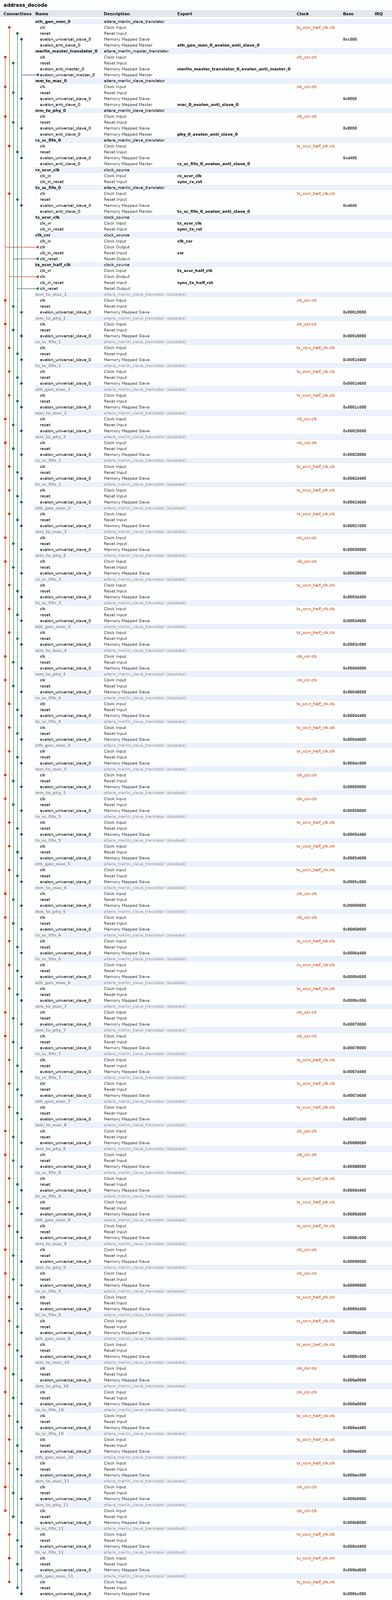
[diagram p0: system contents, whole]
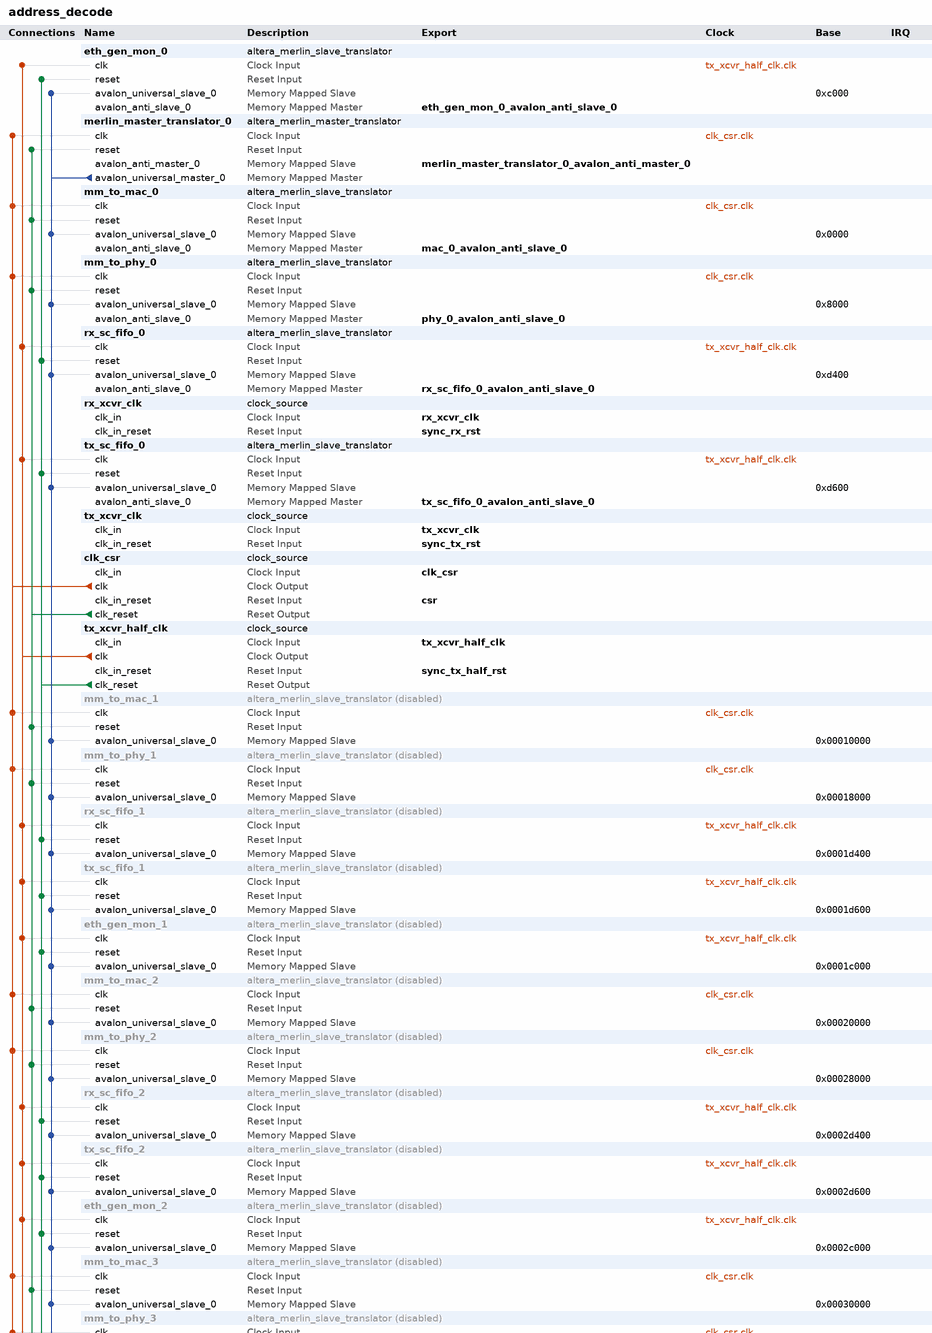
[diagram p1: system contents, upper part]
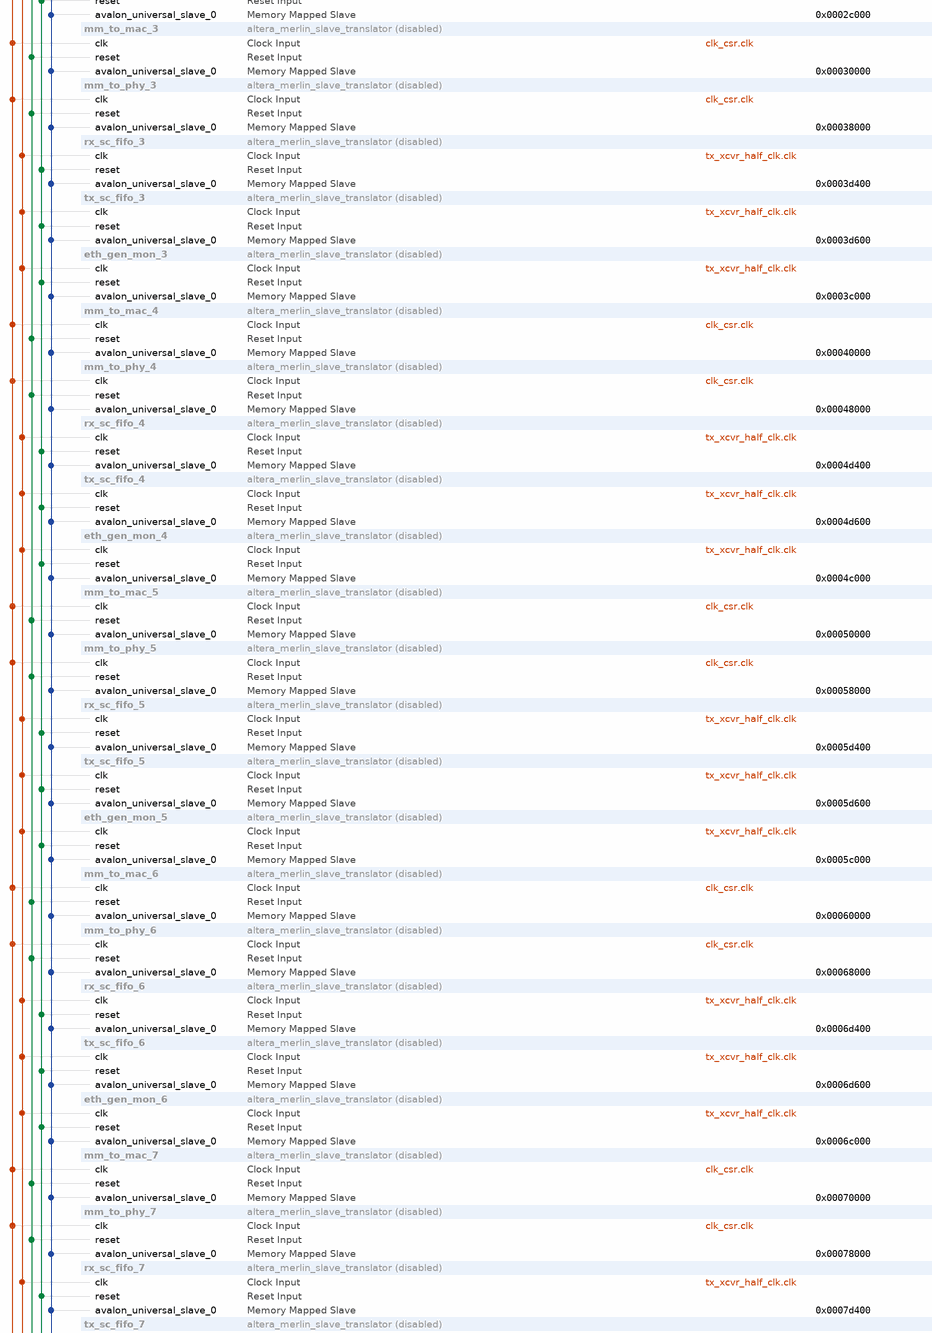
[diagram p2: system contents, middle part]
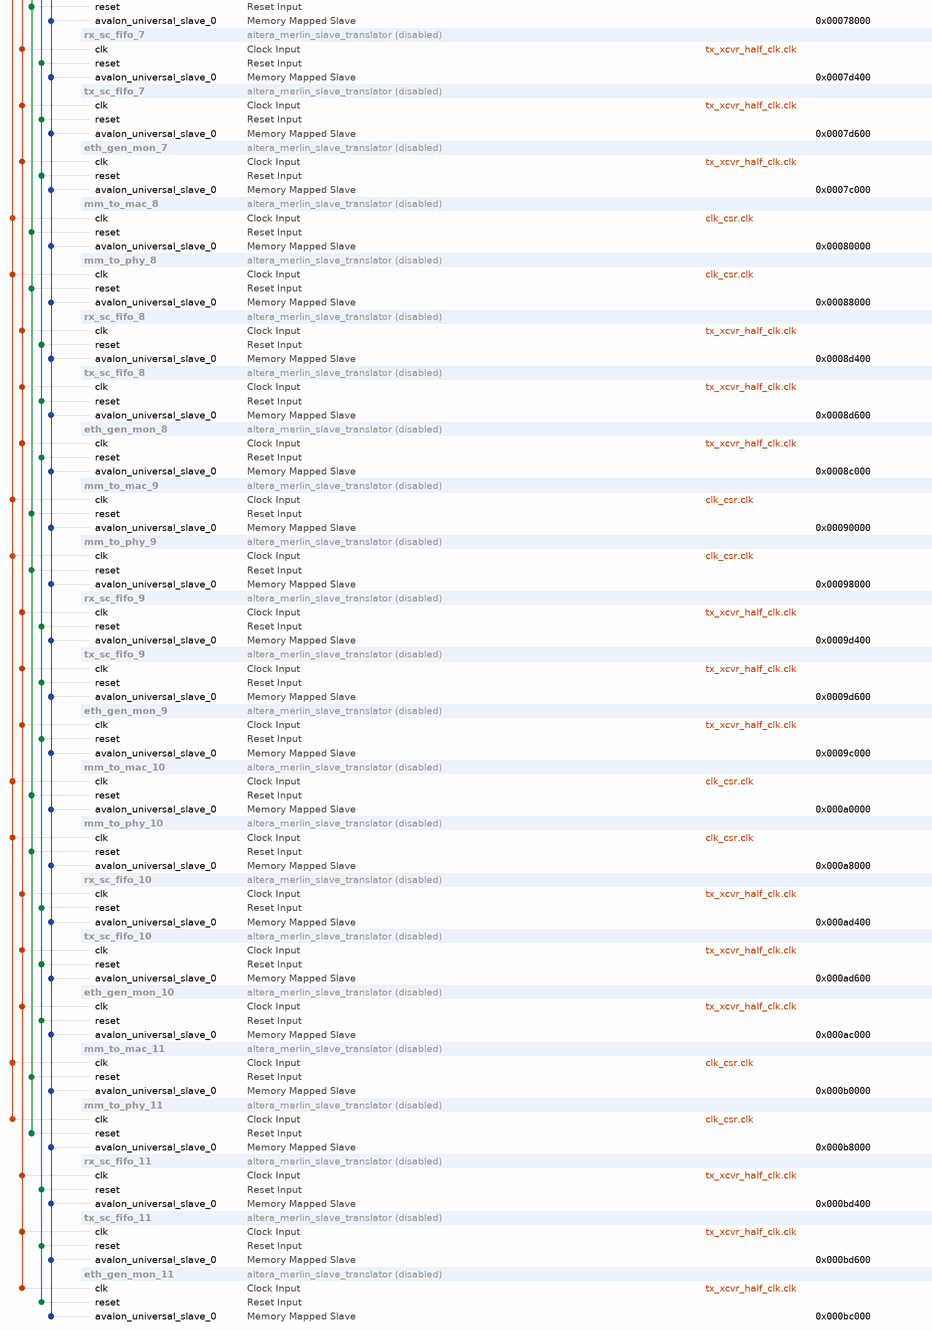
[diagram p3: system contents, lower part]
# Platform Designer (Qsys) system address_decode, Stratix 10 1SG280HU2F50E2VG
# Parameters at their usual value, and those the tool derives, are not listed.
package require -exact qsys 1.0
create_system address_decode
set_project_property DEVICE_FAMILY {Stratix 10}
set_project_property DEVICE 1SG280HU2F50E2VG

add_component eth_gen_mon_0 ip/address_decode/address_decode_eth_gen_mon.ip altera_merlin_slave_translator eth_gen_mon_0 16.925
load_component eth_gen_mon_0
set_component_parameter_value AV_ADDRESS_W 12
set_component_parameter_value AV_DATA_W 32
set_component_parameter_value UAV_DATA_W 32
set_component_parameter_value AV_BURSTCOUNT_W 4
set_component_parameter_value AV_BYTEENABLE_W 4
set_component_parameter_value UAV_BYTEENABLE_W 4
set_component_parameter_value UAV_ADDRESS_W 14
set_component_parameter_value UAV_BURSTCOUNT_W 4
set_component_parameter_value AV_READLATENCY 0
set_component_parameter_value AV_SETUP_WAIT 0
set_component_parameter_value AV_WRITE_WAIT 0
set_component_parameter_value AV_READ_WAIT 1
set_component_parameter_value AV_DATA_HOLD 0
set_component_parameter_value AV_TIMING_UNITS 1
set_component_parameter_value USE_READDATA 1
set_component_parameter_value USE_WRITEDATA 1
set_component_parameter_value USE_READ 1
set_component_parameter_value USE_WRITE 1
set_component_parameter_value USE_BEGINBURSTTRANSFER 0
set_component_parameter_value USE_BEGINTRANSFER 0
set_component_parameter_value USE_BYTEENABLE 0
set_component_parameter_value USE_CHIPSELECT 0
set_component_parameter_value USE_ADDRESS 1
set_component_parameter_value USE_BURSTCOUNT 0
set_component_parameter_value USE_READDATAVALID 0
set_component_parameter_value USE_WAITREQUEST 1
set_component_parameter_value USE_WRITEBYTEENABLE 0
set_component_parameter_value USE_LOCK 0
set_component_parameter_value USE_AV_CLKEN 0
set_component_parameter_value USE_UAV_CLKEN 0
set_component_parameter_value USE_OUTPUTENABLE 0
set_component_parameter_value USE_DEBUGACCESS 0
set_component_parameter_value USE_READRESPONSE 0
set_component_parameter_value USE_WRITERESPONSE 0
set_component_parameter_value AV_SYMBOLS_PER_WORD 4
set_component_parameter_value AV_ADDRESS_SYMBOLS 1
set_component_parameter_value AV_BURSTCOUNT_SYMBOLS 1
set_component_parameter_value AV_CONSTANT_BURST_BEHAVIOR 0
set_component_parameter_value UAV_CONSTANT_BURST_BEHAVIOR 0
set_component_parameter_value AV_REQUIRE_UNALIGNED_ADDRESSES 0
set_component_parameter_value AV_LINEWRAPBURSTS 0
set_component_parameter_value AV_MAX_PENDING_READ_TRANSACTIONS 64
set_component_parameter_value AV_MAX_PENDING_WRITE_TRANSACTIONS 0
set_component_parameter_value AV_BURSTBOUNDARIES 0
set_component_parameter_value AV_INTERLEAVEBURSTS 0
set_component_parameter_value AV_BITS_PER_SYMBOL 8
set_component_parameter_value AV_ISBIGENDIAN 0
set_component_parameter_value AV_ADDRESSGROUP 0
set_component_parameter_value UAV_ADDRESSGROUP 0
set_component_parameter_value AV_REGISTEROUTGOINGSIGNALS 0
set_component_parameter_value AV_REGISTERINCOMINGSIGNALS 0
set_component_parameter_value AV_ALWAYSBURSTMAXBURST 0
set_component_parameter_value CHIPSELECT_THROUGH_READLATENCY 0
set_component_parameter_value CLOCK_RATE 156250000
set_component_parameter_value AV_READ_WAIT_CYCLES 1
set_component_parameter_value AV_WRITE_WAIT_CYCLES 0
set_component_parameter_value AV_SETUP_WAIT_CYCLES 0
set_component_parameter_value AV_DATA_HOLD_CYCLES 0
save_component

add_component merlin_master_translator_0 ip/address_decode/address_decode_merlin_master_translator_0.ip altera_merlin_master_translator merlin_master_translator_0 16.925
load_component merlin_master_translator_0
set_component_parameter_value AV_ADDRESS_W 16
set_component_parameter_value AV_DATA_W 32
set_component_parameter_value AV_BURSTCOUNT_W 1
set_component_parameter_value AV_BYTEENABLE_W 4
set_component_parameter_value UAV_ADDRESS_W 32
set_component_parameter_value UAV_BURSTCOUNT_W 10
set_component_parameter_value AV_READLATENCY 0
set_component_parameter_value AV_WRITE_WAIT 0
set_component_parameter_value AV_READ_WAIT 0
set_component_parameter_value AV_DATA_HOLD 0
set_component_parameter_value AV_SETUP_WAIT 0
set_component_parameter_value USE_READDATA 1
set_component_parameter_value USE_WRITEDATA 1
set_component_parameter_value USE_READ 1
set_component_parameter_value USE_WRITE 1
set_component_parameter_value USE_BEGINBURSTTRANSFER 0
set_component_parameter_value USE_BEGINTRANSFER 0
set_component_parameter_value USE_BYTEENABLE 0
set_component_parameter_value USE_CHIPSELECT 0
set_component_parameter_value USE_ADDRESS 1
set_component_parameter_value USE_BURSTCOUNT 0
set_component_parameter_value USE_DEBUGACCESS 0
set_component_parameter_value USE_CLKEN 0
set_component_parameter_value USE_READDATAVALID 0
set_component_parameter_value USE_WAITREQUEST 1
set_component_parameter_value USE_LOCK 0
set_component_parameter_value USE_READRESPONSE 0
set_component_parameter_value USE_WRITERESPONSE 0
set_component_parameter_value AV_SYMBOLS_PER_WORD 4
set_component_parameter_value AV_ADDRESS_SYMBOLS 0
set_component_parameter_value AV_BURSTCOUNT_SYMBOLS 0
set_component_parameter_value AV_CONSTANT_BURST_BEHAVIOR 0
set_component_parameter_value UAV_CONSTANT_BURST_BEHAVIOR 0
set_component_parameter_value AV_LINEWRAPBURSTS 0
set_component_parameter_value AV_MAX_PENDING_READ_TRANSACTIONS 0
set_component_parameter_value AV_BURSTBOUNDARIES 0
set_component_parameter_value AV_INTERLEAVEBURSTS 0
set_component_parameter_value AV_BITS_PER_SYMBOL 8
set_component_parameter_value AV_ISBIGENDIAN 0
set_component_parameter_value AV_ADDRESSGROUP 0
set_component_parameter_value UAV_ADDRESSGROUP 0
set_component_parameter_value AV_REGISTEROUTGOINGSIGNALS 0
set_component_parameter_value AV_REGISTERINCOMINGSIGNALS 0
set_component_parameter_value AV_ALWAYSBURSTMAXBURST 0
set_component_parameter_value SYNC_RESET 0
save_component

add_component mm_to_mac_0 ip/address_decode/address_decode_mm_to_mac.ip altera_merlin_slave_translator mm_to_mac_0 16.925

add_component mm_to_phy_0 ip/address_decode/address_decode_mm_to_phy.ip altera_merlin_slave_translator mm_to_phy_0 16.925

add_component rx_sc_fifo_0 ip/address_decode/address_decode_rx_sc_fifo.ip altera_merlin_slave_translator rx_sc_fifo_0 16.925
load_component rx_sc_fifo_0
set_component_parameter_value AV_ADDRESS_W 3
set_component_parameter_value AV_DATA_W 32
set_component_parameter_value UAV_DATA_W 32
set_component_parameter_value AV_BURSTCOUNT_W 4
set_component_parameter_value AV_BYTEENABLE_W 4
set_component_parameter_value UAV_BYTEENABLE_W 4
set_component_parameter_value UAV_ADDRESS_W 5
set_component_parameter_value UAV_BURSTCOUNT_W 4
set_component_parameter_value AV_READLATENCY 0
set_component_parameter_value AV_SETUP_WAIT 0
set_component_parameter_value AV_WRITE_WAIT 0
set_component_parameter_value AV_READ_WAIT 1
set_component_parameter_value AV_DATA_HOLD 0
set_component_parameter_value AV_TIMING_UNITS 1
set_component_parameter_value USE_READDATA 1
set_component_parameter_value USE_WRITEDATA 1
set_component_parameter_value USE_READ 1
set_component_parameter_value USE_WRITE 1
set_component_parameter_value USE_BEGINBURSTTRANSFER 0
set_component_parameter_value USE_BEGINTRANSFER 0
set_component_parameter_value USE_BYTEENABLE 0
set_component_parameter_value USE_CHIPSELECT 0
set_component_parameter_value USE_ADDRESS 1
set_component_parameter_value USE_BURSTCOUNT 0
set_component_parameter_value USE_READDATAVALID 0
set_component_parameter_value USE_WAITREQUEST 0
set_component_parameter_value USE_WRITEBYTEENABLE 0
set_component_parameter_value USE_LOCK 0
set_component_parameter_value USE_AV_CLKEN 0
set_component_parameter_value USE_UAV_CLKEN 0
set_component_parameter_value USE_OUTPUTENABLE 0
set_component_parameter_value USE_DEBUGACCESS 0
set_component_parameter_value USE_READRESPONSE 0
set_component_parameter_value USE_WRITERESPONSE 0
set_component_parameter_value AV_SYMBOLS_PER_WORD 4
set_component_parameter_value AV_ADDRESS_SYMBOLS 0
set_component_parameter_value AV_BURSTCOUNT_SYMBOLS 0
set_component_parameter_value AV_CONSTANT_BURST_BEHAVIOR 0
set_component_parameter_value UAV_CONSTANT_BURST_BEHAVIOR 0
set_component_parameter_value AV_REQUIRE_UNALIGNED_ADDRESSES 0
set_component_parameter_value AV_LINEWRAPBURSTS 0
set_component_parameter_value AV_MAX_PENDING_READ_TRANSACTIONS 64
set_component_parameter_value AV_MAX_PENDING_WRITE_TRANSACTIONS 0
set_component_parameter_value AV_BURSTBOUNDARIES 0
set_component_parameter_value AV_INTERLEAVEBURSTS 0
set_component_parameter_value AV_BITS_PER_SYMBOL 8
set_component_parameter_value AV_ISBIGENDIAN 0
set_component_parameter_value AV_ADDRESSGROUP 0
set_component_parameter_value UAV_ADDRESSGROUP 0
set_component_parameter_value AV_REGISTEROUTGOINGSIGNALS 0
set_component_parameter_value AV_REGISTERINCOMINGSIGNALS 0
set_component_parameter_value AV_ALWAYSBURSTMAXBURST 0
set_component_parameter_value CHIPSELECT_THROUGH_READLATENCY 0
set_component_parameter_value CLOCK_RATE 156250000
set_component_parameter_value AV_READ_WAIT_CYCLES 1
set_component_parameter_value AV_WRITE_WAIT_CYCLES 0
set_component_parameter_value AV_SETUP_WAIT_CYCLES 0
set_component_parameter_value AV_DATA_HOLD_CYCLES 0
save_component

add_component rx_xcvr_clk ip/address_decode/address_decode_rx_xcvr_clk.ip clock_source rx_xcvr_clk 

add_component tx_sc_fifo_0 ip/address_decode/address_decode_tx_sc_fifo.ip altera_merlin_slave_translator tx_sc_fifo_0 16.925

add_component tx_xcvr_clk ip/address_decode/address_decode_tx_xcvr_clk.ip clock_source tx_xcvr_clk 
load_component tx_xcvr_clk
set_component_parameter_value clockFrequency 312500000
save_component

add_component clk_csr ip/address_decode/address_decode_clk_csr.ip clock_source clk_csr 

add_component tx_xcvr_half_clk ip/address_decode/address_decode_tx_xcvr_half_clk.ip clock_source tx_xcvr_half_clk 
load_component tx_xcvr_half_clk
set_component_parameter_value clockFrequency 156250000
save_component

add_component mm_to_mac_1 ip/address_decode/address_decode_mm_to_mac.ip altera_merlin_slave_translator mm_to_mac_1 16.925
set_instance_property mm_to_mac_1 ENABLED false

add_component mm_to_phy_1 ip/address_decode/address_decode_mm_to_phy.ip altera_merlin_slave_translator mm_to_phy_1 16.925
set_instance_property mm_to_phy_1 ENABLED false

add_component rx_sc_fifo_1 ip/address_decode/address_decode_rx_sc_fifo.ip altera_merlin_slave_translator rx_sc_fifo_1 16.925
load_component rx_sc_fifo_1
set_instance_property rx_sc_fifo_1 ENABLED false
set_component_parameter_value AV_ADDRESS_W 3
set_component_parameter_value AV_DATA_W 32
set_component_parameter_value UAV_DATA_W 32
set_component_parameter_value AV_BURSTCOUNT_W 4
set_component_parameter_value AV_BYTEENABLE_W 4
set_component_parameter_value UAV_BYTEENABLE_W 4
set_component_parameter_value UAV_ADDRESS_W 5
set_component_parameter_value UAV_BURSTCOUNT_W 4
set_component_parameter_value AV_READLATENCY 0
set_component_parameter_value AV_SETUP_WAIT 0
set_component_parameter_value AV_WRITE_WAIT 0
set_component_parameter_value AV_READ_WAIT 1
set_component_parameter_value AV_DATA_HOLD 0
set_component_parameter_value AV_TIMING_UNITS 1
set_component_parameter_value USE_READDATA 1
set_component_parameter_value USE_WRITEDATA 1
set_component_parameter_value USE_READ 1
set_component_parameter_value USE_WRITE 1
set_component_parameter_value USE_BEGINBURSTTRANSFER 0
set_component_parameter_value USE_BEGINTRANSFER 0
set_component_parameter_value USE_BYTEENABLE 0
set_component_parameter_value USE_CHIPSELECT 0
set_component_parameter_value USE_ADDRESS 1
set_component_parameter_value USE_BURSTCOUNT 0
set_component_parameter_value USE_READDATAVALID 0
set_component_parameter_value USE_WAITREQUEST 0
set_component_parameter_value USE_WRITEBYTEENABLE 0
set_component_parameter_value USE_LOCK 0
set_component_parameter_value USE_AV_CLKEN 0
set_component_parameter_value USE_UAV_CLKEN 0
set_component_parameter_value USE_OUTPUTENABLE 0
set_component_parameter_value USE_DEBUGACCESS 0
set_component_parameter_value USE_READRESPONSE 0
set_component_parameter_value USE_WRITERESPONSE 0
set_component_parameter_value AV_SYMBOLS_PER_WORD 4
set_component_parameter_value AV_ADDRESS_SYMBOLS 0
set_component_parameter_value AV_BURSTCOUNT_SYMBOLS 0
set_component_parameter_value AV_CONSTANT_BURST_BEHAVIOR 0
set_component_parameter_value UAV_CONSTANT_BURST_BEHAVIOR 0
set_component_parameter_value AV_REQUIRE_UNALIGNED_ADDRESSES 0
set_component_parameter_value AV_LINEWRAPBURSTS 0
set_component_parameter_value AV_MAX_PENDING_READ_TRANSACTIONS 64
set_component_parameter_value AV_MAX_PENDING_WRITE_TRANSACTIONS 0
set_component_parameter_value AV_BURSTBOUNDARIES 0
set_component_parameter_value AV_INTERLEAVEBURSTS 0
set_component_parameter_value AV_BITS_PER_SYMBOL 8
set_component_parameter_value AV_ISBIGENDIAN 0
set_component_parameter_value AV_ADDRESSGROUP 0
set_component_parameter_value UAV_ADDRESSGROUP 0
set_component_parameter_value AV_REGISTEROUTGOINGSIGNALS 0
set_component_parameter_value AV_REGISTERINCOMINGSIGNALS 0
set_component_parameter_value AV_ALWAYSBURSTMAXBURST 0
set_component_parameter_value CHIPSELECT_THROUGH_READLATENCY 0
set_component_parameter_value CLOCK_RATE 156250000
set_component_parameter_value AV_READ_WAIT_CYCLES 1
set_component_parameter_value AV_WRITE_WAIT_CYCLES 0
set_component_parameter_value AV_SETUP_WAIT_CYCLES 0
set_component_parameter_value AV_DATA_HOLD_CYCLES 0
save_component

add_component tx_sc_fifo_1 ip/address_decode/address_decode_tx_sc_fifo.ip altera_merlin_slave_translator tx_sc_fifo_1 18.1
set_instance_property tx_sc_fifo_1 ENABLED false

add_component eth_gen_mon_1 ip/address_decode/address_decode_eth_gen_mon.ip altera_merlin_slave_translator eth_gen_mon_1 16.925
load_component eth_gen_mon_1
set_instance_property eth_gen_mon_1 ENABLED false
set_component_parameter_value AV_ADDRESS_W 12
set_component_parameter_value AV_DATA_W 32
set_component_parameter_value UAV_DATA_W 32
set_component_parameter_value AV_BURSTCOUNT_W 4
set_component_parameter_value AV_BYTEENABLE_W 4
set_component_parameter_value UAV_BYTEENABLE_W 4
set_component_parameter_value UAV_ADDRESS_W 14
set_component_parameter_value UAV_BURSTCOUNT_W 4
set_component_parameter_value AV_READLATENCY 0
set_component_parameter_value AV_SETUP_WAIT 0
set_component_parameter_value AV_WRITE_WAIT 0
set_component_parameter_value AV_READ_WAIT 1
set_component_parameter_value AV_DATA_HOLD 0
set_component_parameter_value AV_TIMING_UNITS 1
set_component_parameter_value USE_READDATA 1
set_component_parameter_value USE_WRITEDATA 1
set_component_parameter_value USE_READ 1
set_component_parameter_value USE_WRITE 1
set_component_parameter_value USE_BEGINBURSTTRANSFER 0
set_component_parameter_value USE_BEGINTRANSFER 0
set_component_parameter_value USE_BYTEENABLE 0
set_component_parameter_value USE_CHIPSELECT 0
set_component_parameter_value USE_ADDRESS 1
set_component_parameter_value USE_BURSTCOUNT 0
set_component_parameter_value USE_READDATAVALID 0
set_component_parameter_value USE_WAITREQUEST 1
set_component_parameter_value USE_WRITEBYTEENABLE 0
set_component_parameter_value USE_LOCK 0
set_component_parameter_value USE_AV_CLKEN 0
set_component_parameter_value USE_UAV_CLKEN 0
set_component_parameter_value USE_OUTPUTENABLE 0
set_component_parameter_value USE_DEBUGACCESS 0
set_component_parameter_value USE_READRESPONSE 0
set_component_parameter_value USE_WRITERESPONSE 0
set_component_parameter_value AV_SYMBOLS_PER_WORD 4
set_component_parameter_value AV_ADDRESS_SYMBOLS 1
set_component_parameter_value AV_BURSTCOUNT_SYMBOLS 1
set_component_parameter_value AV_CONSTANT_BURST_BEHAVIOR 0
set_component_parameter_value UAV_CONSTANT_BURST_BEHAVIOR 0
set_component_parameter_value AV_REQUIRE_UNALIGNED_ADDRESSES 0
set_component_parameter_value AV_LINEWRAPBURSTS 0
set_component_parameter_value AV_MAX_PENDING_READ_TRANSACTIONS 64
set_component_parameter_value AV_MAX_PENDING_WRITE_TRANSACTIONS 0
set_component_parameter_value AV_BURSTBOUNDARIES 0
set_component_parameter_value AV_INTERLEAVEBURSTS 0
set_component_parameter_value AV_BITS_PER_SYMBOL 8
set_component_parameter_value AV_ISBIGENDIAN 0
set_component_parameter_value AV_ADDRESSGROUP 0
set_component_parameter_value UAV_ADDRESSGROUP 0
set_component_parameter_value AV_REGISTEROUTGOINGSIGNALS 0
set_component_parameter_value AV_REGISTERINCOMINGSIGNALS 0
set_component_parameter_value AV_ALWAYSBURSTMAXBURST 0
set_component_parameter_value CHIPSELECT_THROUGH_READLATENCY 0
set_component_parameter_value CLOCK_RATE 156250000
set_component_parameter_value AV_READ_WAIT_CYCLES 1
set_component_parameter_value AV_WRITE_WAIT_CYCLES 0
set_component_parameter_value AV_SETUP_WAIT_CYCLES 0
set_component_parameter_value AV_DATA_HOLD_CYCLES 0
save_component

add_component mm_to_mac_2 ip/address_decode/address_decode_mm_to_mac.ip altera_merlin_slave_translator mm_to_mac_2 16.925
set_instance_property mm_to_mac_2 ENABLED false

add_component mm_to_phy_2 ip/address_decode/address_decode_mm_to_phy.ip altera_merlin_slave_translator mm_to_phy_2 16.925
set_instance_property mm_to_phy_2 ENABLED false

add_component rx_sc_fifo_2 ip/address_decode/address_decode_rx_sc_fifo.ip altera_merlin_slave_translator rx_sc_fifo_2 16.925
load_component rx_sc_fifo_2
set_instance_property rx_sc_fifo_2 ENABLED false
set_component_parameter_value AV_ADDRESS_W 3
set_component_parameter_value AV_DATA_W 32
set_component_parameter_value UAV_DATA_W 32
set_component_parameter_value AV_BURSTCOUNT_W 4
set_component_parameter_value AV_BYTEENABLE_W 4
set_component_parameter_value UAV_BYTEENABLE_W 4
set_component_parameter_value UAV_ADDRESS_W 5
set_component_parameter_value UAV_BURSTCOUNT_W 4
set_component_parameter_value AV_READLATENCY 0
set_component_parameter_value AV_SETUP_WAIT 0
set_component_parameter_value AV_WRITE_WAIT 0
set_component_parameter_value AV_READ_WAIT 1
set_component_parameter_value AV_DATA_HOLD 0
set_component_parameter_value AV_TIMING_UNITS 1
set_component_parameter_value USE_READDATA 1
set_component_parameter_value USE_WRITEDATA 1
set_component_parameter_value USE_READ 1
set_component_parameter_value USE_WRITE 1
set_component_parameter_value USE_BEGINBURSTTRANSFER 0
set_component_parameter_value USE_BEGINTRANSFER 0
set_component_parameter_value USE_BYTEENABLE 0
set_component_parameter_value USE_CHIPSELECT 0
set_component_parameter_value USE_ADDRESS 1
set_component_parameter_value USE_BURSTCOUNT 0
set_component_parameter_value USE_READDATAVALID 0
set_component_parameter_value USE_WAITREQUEST 0
set_component_parameter_value USE_WRITEBYTEENABLE 0
set_component_parameter_value USE_LOCK 0
set_component_parameter_value USE_AV_CLKEN 0
set_component_parameter_value USE_UAV_CLKEN 0
set_component_parameter_value USE_OUTPUTENABLE 0
set_component_parameter_value USE_DEBUGACCESS 0
set_component_parameter_value USE_READRESPONSE 0
set_component_parameter_value USE_WRITERESPONSE 0
set_component_parameter_value AV_SYMBOLS_PER_WORD 4
set_component_parameter_value AV_ADDRESS_SYMBOLS 0
set_component_parameter_value AV_BURSTCOUNT_SYMBOLS 0
set_component_parameter_value AV_CONSTANT_BURST_BEHAVIOR 0
set_component_parameter_value UAV_CONSTANT_BURST_BEHAVIOR 0
set_component_parameter_value AV_REQUIRE_UNALIGNED_ADDRESSES 0
set_component_parameter_value AV_LINEWRAPBURSTS 0
set_component_parameter_value AV_MAX_PENDING_READ_TRANSACTIONS 64
set_component_parameter_value AV_MAX_PENDING_WRITE_TRANSACTIONS 0
set_component_parameter_value AV_BURSTBOUNDARIES 0
set_component_parameter_value AV_INTERLEAVEBURSTS 0
set_component_parameter_value AV_BITS_PER_SYMBOL 8
set_component_parameter_value AV_ISBIGENDIAN 0
set_component_parameter_value AV_ADDRESSGROUP 0
set_component_parameter_value UAV_ADDRESSGROUP 0
set_component_parameter_value AV_REGISTEROUTGOINGSIGNALS 0
set_component_parameter_value AV_REGISTERINCOMINGSIGNALS 0
set_component_parameter_value AV_ALWAYSBURSTMAXBURST 0
set_component_parameter_value CHIPSELECT_THROUGH_READLATENCY 0
set_component_parameter_value CLOCK_RATE 156250000
set_component_parameter_value AV_READ_WAIT_CYCLES 1
set_component_parameter_value AV_WRITE_WAIT_CYCLES 0
set_component_parameter_value AV_SETUP_WAIT_CYCLES 0
set_component_parameter_value AV_DATA_HOLD_CYCLES 0
save_component

add_component tx_sc_fifo_2 ip/address_decode/address_decode_tx_sc_fifo.ip altera_merlin_slave_translator tx_sc_fifo_2 16.925
set_instance_property tx_sc_fifo_2 ENABLED false

add_component eth_gen_mon_2 ip/address_decode/address_decode_eth_gen_mon.ip altera_merlin_slave_translator eth_gen_mon_2 16.925
load_component eth_gen_mon_2
set_instance_property eth_gen_mon_2 ENABLED false
set_component_parameter_value AV_ADDRESS_W 12
set_component_parameter_value AV_DATA_W 32
set_component_parameter_value UAV_DATA_W 32
set_component_parameter_value AV_BURSTCOUNT_W 4
set_component_parameter_value AV_BYTEENABLE_W 4
set_component_parameter_value UAV_BYTEENABLE_W 4
set_component_parameter_value UAV_ADDRESS_W 14
set_component_parameter_value UAV_BURSTCOUNT_W 4
set_component_parameter_value AV_READLATENCY 0
set_component_parameter_value AV_SETUP_WAIT 0
set_component_parameter_value AV_WRITE_WAIT 0
set_component_parameter_value AV_READ_WAIT 1
set_component_parameter_value AV_DATA_HOLD 0
set_component_parameter_value AV_TIMING_UNITS 1
set_component_parameter_value USE_READDATA 1
set_component_parameter_value USE_WRITEDATA 1
set_component_parameter_value USE_READ 1
set_component_parameter_value USE_WRITE 1
set_component_parameter_value USE_BEGINBURSTTRANSFER 0
set_component_parameter_value USE_BEGINTRANSFER 0
set_component_parameter_value USE_BYTEENABLE 0
set_component_parameter_value USE_CHIPSELECT 0
set_component_parameter_value USE_ADDRESS 1
set_component_parameter_value USE_BURSTCOUNT 0
set_component_parameter_value USE_READDATAVALID 0
set_component_parameter_value USE_WAITREQUEST 1
set_component_parameter_value USE_WRITEBYTEENABLE 0
set_component_parameter_value USE_LOCK 0
set_component_parameter_value USE_AV_CLKEN 0
set_component_parameter_value USE_UAV_CLKEN 0
set_component_parameter_value USE_OUTPUTENABLE 0
set_component_parameter_value USE_DEBUGACCESS 0
set_component_parameter_value USE_READRESPONSE 0
set_component_parameter_value USE_WRITERESPONSE 0
set_component_parameter_value AV_SYMBOLS_PER_WORD 4
set_component_parameter_value AV_ADDRESS_SYMBOLS 1
set_component_parameter_value AV_BURSTCOUNT_SYMBOLS 1
set_component_parameter_value AV_CONSTANT_BURST_BEHAVIOR 0
set_component_parameter_value UAV_CONSTANT_BURST_BEHAVIOR 0
set_component_parameter_value AV_REQUIRE_UNALIGNED_ADDRESSES 0
set_component_parameter_value AV_LINEWRAPBURSTS 0
set_component_parameter_value AV_MAX_PENDING_READ_TRANSACTIONS 64
set_component_parameter_value AV_MAX_PENDING_WRITE_TRANSACTIONS 0
set_component_parameter_value AV_BURSTBOUNDARIES 0
set_component_parameter_value AV_INTERLEAVEBURSTS 0
set_component_parameter_value AV_BITS_PER_SYMBOL 8
set_component_parameter_value AV_ISBIGENDIAN 0
set_component_parameter_value AV_ADDRESSGROUP 0
set_component_parameter_value UAV_ADDRESSGROUP 0
set_component_parameter_value AV_REGISTEROUTGOINGSIGNALS 0
set_component_parameter_value AV_REGISTERINCOMINGSIGNALS 0
set_component_parameter_value AV_ALWAYSBURSTMAXBURST 0
set_component_parameter_value CHIPSELECT_THROUGH_READLATENCY 0
set_component_parameter_value CLOCK_RATE 156250000
set_component_parameter_value AV_READ_WAIT_CYCLES 1
set_component_parameter_value AV_WRITE_WAIT_CYCLES 0
set_component_parameter_value AV_SETUP_WAIT_CYCLES 0
set_component_parameter_value AV_DATA_HOLD_CYCLES 0
save_component

add_component mm_to_mac_3 ip/address_decode/address_decode_mm_to_mac.ip altera_merlin_slave_translator mm_to_mac_3 16.925
set_instance_property mm_to_mac_3 ENABLED false

add_component mm_to_phy_3 ip/address_decode/address_decode_mm_to_phy.ip altera_merlin_slave_translator mm_to_phy_3 16.925
set_instance_property mm_to_phy_3 ENABLED false

add_component rx_sc_fifo_3 ip/address_decode/address_decode_rx_sc_fifo.ip altera_merlin_slave_translator rx_sc_fifo_3 16.925
load_component rx_sc_fifo_3
set_instance_property rx_sc_fifo_3 ENABLED false
set_component_parameter_value AV_ADDRESS_W 3
set_component_parameter_value AV_DATA_W 32
set_component_parameter_value UAV_DATA_W 32
set_component_parameter_value AV_BURSTCOUNT_W 4
set_component_parameter_value AV_BYTEENABLE_W 4
set_component_parameter_value UAV_BYTEENABLE_W 4
set_component_parameter_value UAV_ADDRESS_W 5
set_component_parameter_value UAV_BURSTCOUNT_W 4
set_component_parameter_value AV_READLATENCY 0
set_component_parameter_value AV_SETUP_WAIT 0
set_component_parameter_value AV_WRITE_WAIT 0
set_component_parameter_value AV_READ_WAIT 1
set_component_parameter_value AV_DATA_HOLD 0
set_component_parameter_value AV_TIMING_UNITS 1
set_component_parameter_value USE_READDATA 1
set_component_parameter_value USE_WRITEDATA 1
set_component_parameter_value USE_READ 1
set_component_parameter_value USE_WRITE 1
set_component_parameter_value USE_BEGINBURSTTRANSFER 0
set_component_parameter_value USE_BEGINTRANSFER 0
set_component_parameter_value USE_BYTEENABLE 0
set_component_parameter_value USE_CHIPSELECT 0
set_component_parameter_value USE_ADDRESS 1
set_component_parameter_value USE_BURSTCOUNT 0
set_component_parameter_value USE_READDATAVALID 0
set_component_parameter_value USE_WAITREQUEST 0
set_component_parameter_value USE_WRITEBYTEENABLE 0
set_component_parameter_value USE_LOCK 0
set_component_parameter_value USE_AV_CLKEN 0
set_component_parameter_value USE_UAV_CLKEN 0
set_component_parameter_value USE_OUTPUTENABLE 0
set_component_parameter_value USE_DEBUGACCESS 0
set_component_parameter_value USE_READRESPONSE 0
set_component_parameter_value USE_WRITERESPONSE 0
set_component_parameter_value AV_SYMBOLS_PER_WORD 4
set_component_parameter_value AV_ADDRESS_SYMBOLS 0
set_component_parameter_value AV_BURSTCOUNT_SYMBOLS 0
set_component_parameter_value AV_CONSTANT_BURST_BEHAVIOR 0
set_component_parameter_value UAV_CONSTANT_BURST_BEHAVIOR 0
set_component_parameter_value AV_REQUIRE_UNALIGNED_ADDRESSES 0
set_component_parameter_value AV_LINEWRAPBURSTS 0
set_component_parameter_value AV_MAX_PENDING_READ_TRANSACTIONS 64
set_component_parameter_value AV_MAX_PENDING_WRITE_TRANSACTIONS 0
set_component_parameter_value AV_BURSTBOUNDARIES 0
set_component_parameter_value AV_INTERLEAVEBURSTS 0
set_component_parameter_value AV_BITS_PER_SYMBOL 8
set_component_parameter_value AV_ISBIGENDIAN 0
set_component_parameter_value AV_ADDRESSGROUP 0
set_component_parameter_value UAV_ADDRESSGROUP 0
set_component_parameter_value AV_REGISTEROUTGOINGSIGNALS 0
set_component_parameter_value AV_REGISTERINCOMINGSIGNALS 0
set_component_parameter_value AV_ALWAYSBURSTMAXBURST 0
set_component_parameter_value CHIPSELECT_THROUGH_READLATENCY 0
set_component_parameter_value CLOCK_RATE 156250000
set_component_parameter_value AV_READ_WAIT_CYCLES 1
set_component_parameter_value AV_WRITE_WAIT_CYCLES 0
set_component_parameter_value AV_SETUP_WAIT_CYCLES 0
set_component_parameter_value AV_DATA_HOLD_CYCLES 0
save_component

add_component tx_sc_fifo_3 ip/address_decode/address_decode_tx_sc_fifo.ip altera_merlin_slave_translator tx_sc_fifo_3 16.925
set_instance_property tx_sc_fifo_3 ENABLED false

add_component eth_gen_mon_3 ip/address_decode/address_decode_eth_gen_mon.ip altera_merlin_slave_translator eth_gen_mon_3 16.925
load_component eth_gen_mon_3
set_instance_property eth_gen_mon_3 ENABLED false
set_component_parameter_value AV_ADDRESS_W 12
set_component_parameter_value AV_DATA_W 32
set_component_parameter_value UAV_DATA_W 32
set_component_parameter_value AV_BURSTCOUNT_W 4
set_component_parameter_value AV_BYTEENABLE_W 4
set_component_parameter_value UAV_BYTEENABLE_W 4
set_component_parameter_value UAV_ADDRESS_W 14
set_component_parameter_value UAV_BURSTCOUNT_W 4
set_component_parameter_value AV_READLATENCY 0
set_component_parameter_value AV_SETUP_WAIT 0
set_component_parameter_value AV_WRITE_WAIT 0
set_component_parameter_value AV_READ_WAIT 1
set_component_parameter_value AV_DATA_HOLD 0
set_component_parameter_value AV_TIMING_UNITS 1
set_component_parameter_value USE_READDATA 1
set_component_parameter_value USE_WRITEDATA 1
set_component_parameter_value USE_READ 1
set_component_parameter_value USE_WRITE 1
set_component_parameter_value USE_BEGINBURSTTRANSFER 0
set_component_parameter_value USE_BEGINTRANSFER 0
set_component_parameter_value USE_BYTEENABLE 0
set_component_parameter_value USE_CHIPSELECT 0
set_component_parameter_value USE_ADDRESS 1
set_component_parameter_value USE_BURSTCOUNT 0
set_component_parameter_value USE_READDATAVALID 0
set_component_parameter_value USE_WAITREQUEST 1
set_component_parameter_value USE_WRITEBYTEENABLE 0
set_component_parameter_value USE_LOCK 0
set_component_parameter_value USE_AV_CLKEN 0
set_component_parameter_value USE_UAV_CLKEN 0
set_component_parameter_value USE_OUTPUTENABLE 0
set_component_parameter_value USE_DEBUGACCESS 0
set_component_parameter_value USE_READRESPONSE 0
set_component_parameter_value USE_WRITERESPONSE 0
set_component_parameter_value AV_SYMBOLS_PER_WORD 4
set_component_parameter_value AV_ADDRESS_SYMBOLS 1
set_component_parameter_value AV_BURSTCOUNT_SYMBOLS 1
set_component_parameter_value AV_CONSTANT_BURST_BEHAVIOR 0
set_component_parameter_value UAV_CONSTANT_BURST_BEHAVIOR 0
set_component_parameter_value AV_REQUIRE_UNALIGNED_ADDRESSES 0
set_component_parameter_value AV_LINEWRAPBURSTS 0
set_component_parameter_value AV_MAX_PENDING_READ_TRANSACTIONS 64
set_component_parameter_value AV_MAX_PENDING_WRITE_TRANSACTIONS 0
set_component_parameter_value AV_BURSTBOUNDARIES 0
set_component_parameter_value AV_INTERLEAVEBURSTS 0
set_component_parameter_value AV_BITS_PER_SYMBOL 8
set_component_parameter_value AV_ISBIGENDIAN 0
set_component_parameter_value AV_ADDRESSGROUP 0
set_component_parameter_value UAV_ADDRESSGROUP 0
set_component_parameter_value AV_REGISTEROUTGOINGSIGNALS 0
set_component_parameter_value AV_REGISTERINCOMINGSIGNALS 0
set_component_parameter_value AV_ALWAYSBURSTMAXBURST 0
set_component_parameter_value CHIPSELECT_THROUGH_READLATENCY 0
set_component_parameter_value CLOCK_RATE 156250000
set_component_parameter_value AV_READ_WAIT_CYCLES 1
set_component_parameter_value AV_WRITE_WAIT_CYCLES 0
set_component_parameter_value AV_SETUP_WAIT_CYCLES 0
set_component_parameter_value AV_DATA_HOLD_CYCLES 0
save_component

add_component mm_to_mac_4 ip/address_decode/address_decode_mm_to_mac.ip altera_merlin_slave_translator mm_to_mac_4 16.925
set_instance_property mm_to_mac_4 ENABLED false

add_component mm_to_phy_4 ip/address_decode/address_decode_mm_to_phy.ip altera_merlin_slave_translator mm_to_phy_4 16.925
set_instance_property mm_to_phy_4 ENABLED false

add_component rx_sc_fifo_4 ip/address_decode/address_decode_rx_sc_fifo.ip altera_merlin_slave_translator rx_sc_fifo_4 16.925
load_component rx_sc_fifo_4
set_instance_property rx_sc_fifo_4 ENABLED false
set_component_parameter_value AV_ADDRESS_W 3
set_component_parameter_value AV_DATA_W 32
set_component_parameter_value UAV_DATA_W 32
set_component_parameter_value AV_BURSTCOUNT_W 4
set_component_parameter_value AV_BYTEENABLE_W 4
set_component_parameter_value UAV_BYTEENABLE_W 4
set_component_parameter_value UAV_ADDRESS_W 5
set_component_parameter_value UAV_BURSTCOUNT_W 4
set_component_parameter_value AV_READLATENCY 0
set_component_parameter_value AV_SETUP_WAIT 0
set_component_parameter_value AV_WRITE_WAIT 0
set_component_parameter_value AV_READ_WAIT 1
set_component_parameter_value AV_DATA_HOLD 0
set_component_parameter_value AV_TIMING_UNITS 1
set_component_parameter_value USE_READDATA 1
set_component_parameter_value USE_WRITEDATA 1
set_component_parameter_value USE_READ 1
set_component_parameter_value USE_WRITE 1
set_component_parameter_value USE_BEGINBURSTTRANSFER 0
set_component_parameter_value USE_BEGINTRANSFER 0
set_component_parameter_value USE_BYTEENABLE 0
set_component_parameter_value USE_CHIPSELECT 0
set_component_parameter_value USE_ADDRESS 1
set_component_parameter_value USE_BURSTCOUNT 0
set_component_parameter_value USE_READDATAVALID 0
set_component_parameter_value USE_WAITREQUEST 0
set_component_parameter_value USE_WRITEBYTEENABLE 0
set_component_parameter_value USE_LOCK 0
set_component_parameter_value USE_AV_CLKEN 0
set_component_parameter_value USE_UAV_CLKEN 0
set_component_parameter_value USE_OUTPUTENABLE 0
set_component_parameter_value USE_DEBUGACCESS 0
set_component_parameter_value USE_READRESPONSE 0
set_component_parameter_value USE_WRITERESPONSE 0
set_component_parameter_value AV_SYMBOLS_PER_WORD 4
set_component_parameter_value AV_ADDRESS_SYMBOLS 0
set_component_parameter_value AV_BURSTCOUNT_SYMBOLS 0
set_component_parameter_value AV_CONSTANT_BURST_BEHAVIOR 0
set_component_parameter_value UAV_CONSTANT_BURST_BEHAVIOR 0
set_component_parameter_value AV_REQUIRE_UNALIGNED_ADDRESSES 0
set_component_parameter_value AV_LINEWRAPBURSTS 0
set_component_parameter_value AV_MAX_PENDING_READ_TRANSACTIONS 64
set_component_parameter_value AV_MAX_PENDING_WRITE_TRANSACTIONS 0
set_component_parameter_value AV_BURSTBOUNDARIES 0
set_component_parameter_value AV_INTERLEAVEBURSTS 0
set_component_parameter_value AV_BITS_PER_SYMBOL 8
set_component_parameter_value AV_ISBIGENDIAN 0
set_component_parameter_value AV_ADDRESSGROUP 0
set_component_parameter_value UAV_ADDRESSGROUP 0
set_component_parameter_value AV_REGISTEROUTGOINGSIGNALS 0
set_component_parameter_value AV_REGISTERINCOMINGSIGNALS 0
set_component_parameter_value AV_ALWAYSBURSTMAXBURST 0
set_component_parameter_value CHIPSELECT_THROUGH_READLATENCY 0
set_component_parameter_value CLOCK_RATE 156250000
set_component_parameter_value AV_READ_WAIT_CYCLES 1
set_component_parameter_value AV_WRITE_WAIT_CYCLES 0
set_component_parameter_value AV_SETUP_WAIT_CYCLES 0
set_component_parameter_value AV_DATA_HOLD_CYCLES 0
save_component

add_component tx_sc_fifo_4 ip/address_decode/address_decode_tx_sc_fifo.ip altera_merlin_slave_translator tx_sc_fifo_4 16.925
set_instance_property tx_sc_fifo_4 ENABLED false

add_component eth_gen_mon_4 ip/address_decode/address_decode_eth_gen_mon.ip altera_merlin_slave_translator eth_gen_mon_4 16.925
load_component eth_gen_mon_4
set_instance_property eth_gen_mon_4 ENABLED false
set_component_parameter_value AV_ADDRESS_W 12
set_component_parameter_value AV_DATA_W 32
set_component_parameter_value UAV_DATA_W 32
set_component_parameter_value AV_BURSTCOUNT_W 4
set_component_parameter_value AV_BYTEENABLE_W 4
set_component_parameter_value UAV_BYTEENABLE_W 4
set_component_parameter_value UAV_ADDRESS_W 14
set_component_parameter_value UAV_BURSTCOUNT_W 4
set_component_parameter_value AV_READLATENCY 0
set_component_parameter_value AV_SETUP_WAIT 0
set_component_parameter_value AV_WRITE_WAIT 0
set_component_parameter_value AV_READ_WAIT 1
set_component_parameter_value AV_DATA_HOLD 0
set_component_parameter_value AV_TIMING_UNITS 1
set_component_parameter_value USE_READDATA 1
set_component_parameter_value USE_WRITEDATA 1
set_component_parameter_value USE_READ 1
set_component_parameter_value USE_WRITE 1
set_component_parameter_value USE_BEGINBURSTTRANSFER 0
set_component_parameter_value USE_BEGINTRANSFER 0
set_component_parameter_value USE_BYTEENABLE 0
set_component_parameter_value USE_CHIPSELECT 0
set_component_parameter_value USE_ADDRESS 1
set_component_parameter_value USE_BURSTCOUNT 0
set_component_parameter_value USE_READDATAVALID 0
set_component_parameter_value USE_WAITREQUEST 1
set_component_parameter_value USE_WRITEBYTEENABLE 0
set_component_parameter_value USE_LOCK 0
set_component_parameter_value USE_AV_CLKEN 0
set_component_parameter_value USE_UAV_CLKEN 0
set_component_parameter_value USE_OUTPUTENABLE 0
set_component_parameter_value USE_DEBUGACCESS 0
set_component_parameter_value USE_READRESPONSE 0
set_component_parameter_value USE_WRITERESPONSE 0
set_component_parameter_value AV_SYMBOLS_PER_WORD 4
set_component_parameter_value AV_ADDRESS_SYMBOLS 1
set_component_parameter_value AV_BURSTCOUNT_SYMBOLS 1
set_component_parameter_value AV_CONSTANT_BURST_BEHAVIOR 0
set_component_parameter_value UAV_CONSTANT_BURST_BEHAVIOR 0
set_component_parameter_value AV_REQUIRE_UNALIGNED_ADDRESSES 0
set_component_parameter_value AV_LINEWRAPBURSTS 0
set_component_parameter_value AV_MAX_PENDING_READ_TRANSACTIONS 64
set_component_parameter_value AV_MAX_PENDING_WRITE_TRANSACTIONS 0
set_component_parameter_value AV_BURSTBOUNDARIES 0
set_component_parameter_value AV_INTERLEAVEBURSTS 0
set_component_parameter_value AV_BITS_PER_SYMBOL 8
set_component_parameter_value AV_ISBIGENDIAN 0
set_component_parameter_value AV_ADDRESSGROUP 0
set_component_parameter_value UAV_ADDRESSGROUP 0
set_component_parameter_value AV_REGISTEROUTGOINGSIGNALS 0
set_component_parameter_value AV_REGISTERINCOMINGSIGNALS 0
set_component_parameter_value AV_ALWAYSBURSTMAXBURST 0
set_component_parameter_value CHIPSELECT_THROUGH_READLATENCY 0
set_component_parameter_value CLOCK_RATE 156250000
set_component_parameter_value AV_READ_WAIT_CYCLES 1
set_component_parameter_value AV_WRITE_WAIT_CYCLES 0
set_component_parameter_value AV_SETUP_WAIT_CYCLES 0
set_component_parameter_value AV_DATA_HOLD_CYCLES 0
save_component

add_component mm_to_mac_5 ip/address_decode/address_decode_mm_to_mac.ip altera_merlin_slave_translator mm_to_mac_5 16.925
set_instance_property mm_to_mac_5 ENABLED false

add_component mm_to_phy_5 ip/address_decode/address_decode_mm_to_phy.ip altera_merlin_slave_translator mm_to_phy_5 16.925
set_instance_property mm_to_phy_5 ENABLED false

add_component rx_sc_fifo_5 ip/address_decode/address_decode_rx_sc_fifo.ip altera_merlin_slave_translator rx_sc_fifo_5 16.925
load_component rx_sc_fifo_5
set_instance_property rx_sc_fifo_5 ENABLED false
set_component_parameter_value AV_ADDRESS_W 3
set_component_parameter_value AV_DATA_W 32
set_component_parameter_value UAV_DATA_W 32
set_component_parameter_value AV_BURSTCOUNT_W 4
set_component_parameter_value AV_BYTEENABLE_W 4
set_component_parameter_value UAV_BYTEENABLE_W 4
set_component_parameter_value UAV_ADDRESS_W 5
set_component_parameter_value UAV_BURSTCOUNT_W 4
set_component_parameter_value AV_READLATENCY 0
set_component_parameter_value AV_SETUP_WAIT 0
set_component_parameter_value AV_WRITE_WAIT 0
set_component_parameter_value AV_READ_WAIT 1
set_component_parameter_value AV_DATA_HOLD 0
set_component_parameter_value AV_TIMING_UNITS 1
set_component_parameter_value USE_READDATA 1
set_component_parameter_value USE_WRITEDATA 1
set_component_parameter_value USE_READ 1
set_component_parameter_value USE_WRITE 1
set_component_parameter_value USE_BEGINBURSTTRANSFER 0
set_component_parameter_value USE_BEGINTRANSFER 0
set_component_parameter_value USE_BYTEENABLE 0
set_component_parameter_value USE_CHIPSELECT 0
set_component_parameter_value USE_ADDRESS 1
set_component_parameter_value USE_BURSTCOUNT 0
set_component_parameter_value USE_READDATAVALID 0
set_component_parameter_value USE_WAITREQUEST 0
set_component_parameter_value USE_WRITEBYTEENABLE 0
set_component_parameter_value USE_LOCK 0
set_component_parameter_value USE_AV_CLKEN 0
set_component_parameter_value USE_UAV_CLKEN 0
set_component_parameter_value USE_OUTPUTENABLE 0
set_component_parameter_value USE_DEBUGACCESS 0
set_component_parameter_value USE_READRESPONSE 0
set_component_parameter_value USE_WRITERESPONSE 0
set_component_parameter_value AV_SYMBOLS_PER_WORD 4
set_component_parameter_value AV_ADDRESS_SYMBOLS 0
set_component_parameter_value AV_BURSTCOUNT_SYMBOLS 0
set_component_parameter_value AV_CONSTANT_BURST_BEHAVIOR 0
set_component_parameter_value UAV_CONSTANT_BURST_BEHAVIOR 0
set_component_parameter_value AV_REQUIRE_UNALIGNED_ADDRESSES 0
set_component_parameter_value AV_LINEWRAPBURSTS 0
set_component_parameter_value AV_MAX_PENDING_READ_TRANSACTIONS 64
set_component_parameter_value AV_MAX_PENDING_WRITE_TRANSACTIONS 0
set_component_parameter_value AV_BURSTBOUNDARIES 0
set_component_parameter_value AV_INTERLEAVEBURSTS 0
set_component_parameter_value AV_BITS_PER_SYMBOL 8
set_component_parameter_value AV_ISBIGENDIAN 0
set_component_parameter_value AV_ADDRESSGROUP 0
set_component_parameter_value UAV_ADDRESSGROUP 0
set_component_parameter_value AV_REGISTEROUTGOINGSIGNALS 0
set_component_parameter_value AV_REGISTERINCOMINGSIGNALS 0
set_component_parameter_value AV_ALWAYSBURSTMAXBURST 0
set_component_parameter_value CHIPSELECT_THROUGH_READLATENCY 0
set_component_parameter_value CLOCK_RATE 156250000
set_component_parameter_value AV_READ_WAIT_CYCLES 1
set_component_parameter_value AV_WRITE_WAIT_CYCLES 0
set_component_parameter_value AV_SETUP_WAIT_CYCLES 0
set_component_parameter_value AV_DATA_HOLD_CYCLES 0
save_component

add_component tx_sc_fifo_5 ip/address_decode/address_decode_tx_sc_fifo.ip altera_merlin_slave_translator tx_sc_fifo_5 16.925
set_instance_property tx_sc_fifo_5 ENABLED false

add_component eth_gen_mon_5 ip/address_decode/address_decode_eth_gen_mon.ip altera_merlin_slave_translator eth_gen_mon_5 16.925
load_component eth_gen_mon_5
set_instance_property eth_gen_mon_5 ENABLED false
set_component_parameter_value AV_ADDRESS_W 12
set_component_parameter_value AV_DATA_W 32
set_component_parameter_value UAV_DATA_W 32
set_component_parameter_value AV_BURSTCOUNT_W 4
set_component_parameter_value AV_BYTEENABLE_W 4
set_component_parameter_value UAV_BYTEENABLE_W 4
set_component_parameter_value UAV_ADDRESS_W 14
set_component_parameter_value UAV_BURSTCOUNT_W 4
set_component_parameter_value AV_READLATENCY 0
set_component_parameter_value AV_SETUP_WAIT 0
set_component_parameter_value AV_WRITE_WAIT 0
set_component_parameter_value AV_READ_WAIT 1
set_component_parameter_value AV_DATA_HOLD 0
set_component_parameter_value AV_TIMING_UNITS 1
set_component_parameter_value USE_READDATA 1
set_component_parameter_value USE_WRITEDATA 1
set_component_parameter_value USE_READ 1
set_component_parameter_value USE_WRITE 1
set_component_parameter_value USE_BEGINBURSTTRANSFER 0
set_component_parameter_value USE_BEGINTRANSFER 0
set_component_parameter_value USE_BYTEENABLE 0
set_component_parameter_value USE_CHIPSELECT 0
set_component_parameter_value USE_ADDRESS 1
set_component_parameter_value USE_BURSTCOUNT 0
set_component_parameter_value USE_READDATAVALID 0
set_component_parameter_value USE_WAITREQUEST 1
set_component_parameter_value USE_WRITEBYTEENABLE 0
set_component_parameter_value USE_LOCK 0
set_component_parameter_value USE_AV_CLKEN 0
set_component_parameter_value USE_UAV_CLKEN 0
set_component_parameter_value USE_OUTPUTENABLE 0
set_component_parameter_value USE_DEBUGACCESS 0
set_component_parameter_value USE_READRESPONSE 0
set_component_parameter_value USE_WRITERESPONSE 0
set_component_parameter_value AV_SYMBOLS_PER_WORD 4
set_component_parameter_value AV_ADDRESS_SYMBOLS 1
set_component_parameter_value AV_BURSTCOUNT_SYMBOLS 1
set_component_parameter_value AV_CONSTANT_BURST_BEHAVIOR 0
set_component_parameter_value UAV_CONSTANT_BURST_BEHAVIOR 0
set_component_parameter_value AV_REQUIRE_UNALIGNED_ADDRESSES 0
set_component_parameter_value AV_LINEWRAPBURSTS 0
set_component_parameter_value AV_MAX_PENDING_READ_TRANSACTIONS 64
set_component_parameter_value AV_MAX_PENDING_WRITE_TRANSACTIONS 0
set_component_parameter_value AV_BURSTBOUNDARIES 0
set_component_parameter_value AV_INTERLEAVEBURSTS 0
set_component_parameter_value AV_BITS_PER_SYMBOL 8
set_component_parameter_value AV_ISBIGENDIAN 0
set_component_parameter_value AV_ADDRESSGROUP 0
set_component_parameter_value UAV_ADDRESSGROUP 0
set_component_parameter_value AV_REGISTEROUTGOINGSIGNALS 0
set_component_parameter_value AV_REGISTERINCOMINGSIGNALS 0
set_component_parameter_value AV_ALWAYSBURSTMAXBURST 0
set_component_parameter_value CHIPSELECT_THROUGH_READLATENCY 0
set_component_parameter_value CLOCK_RATE 156250000
set_component_parameter_value AV_READ_WAIT_CYCLES 1
set_component_parameter_value AV_WRITE_WAIT_CYCLES 0
set_component_parameter_value AV_SETUP_WAIT_CYCLES 0
set_component_parameter_value AV_DATA_HOLD_CYCLES 0
save_component
